# EAGLE design Down (EAGLE 8.6.0)

## Sheet 1 of 2
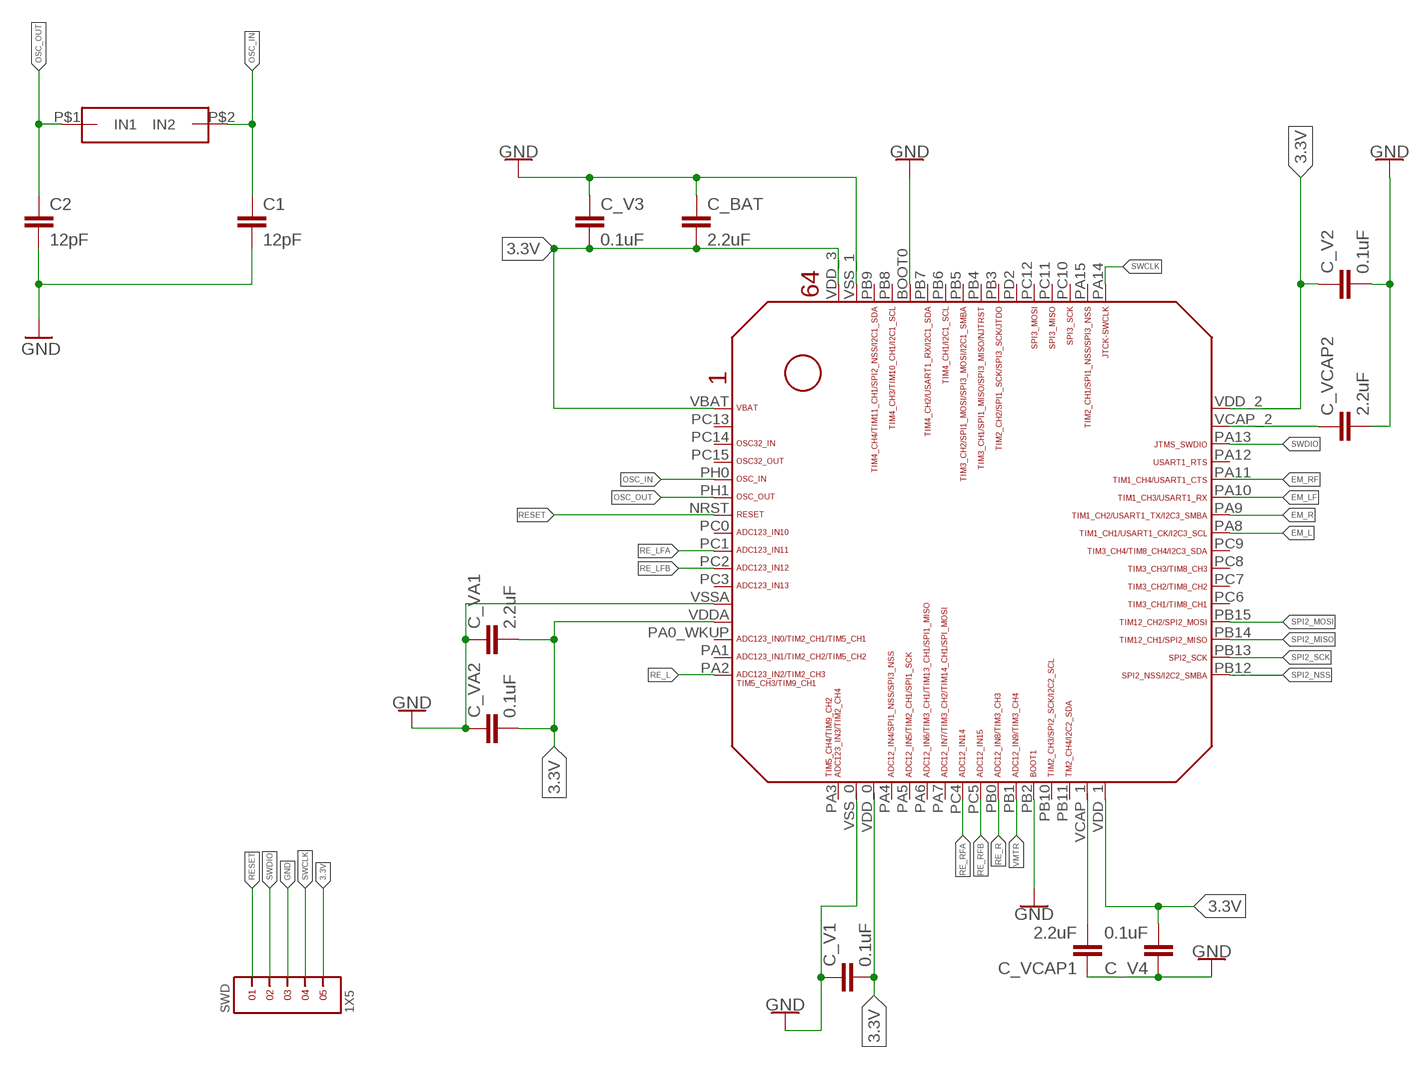
[diagram p0: schematic, sheet 1, part 1 of 3]
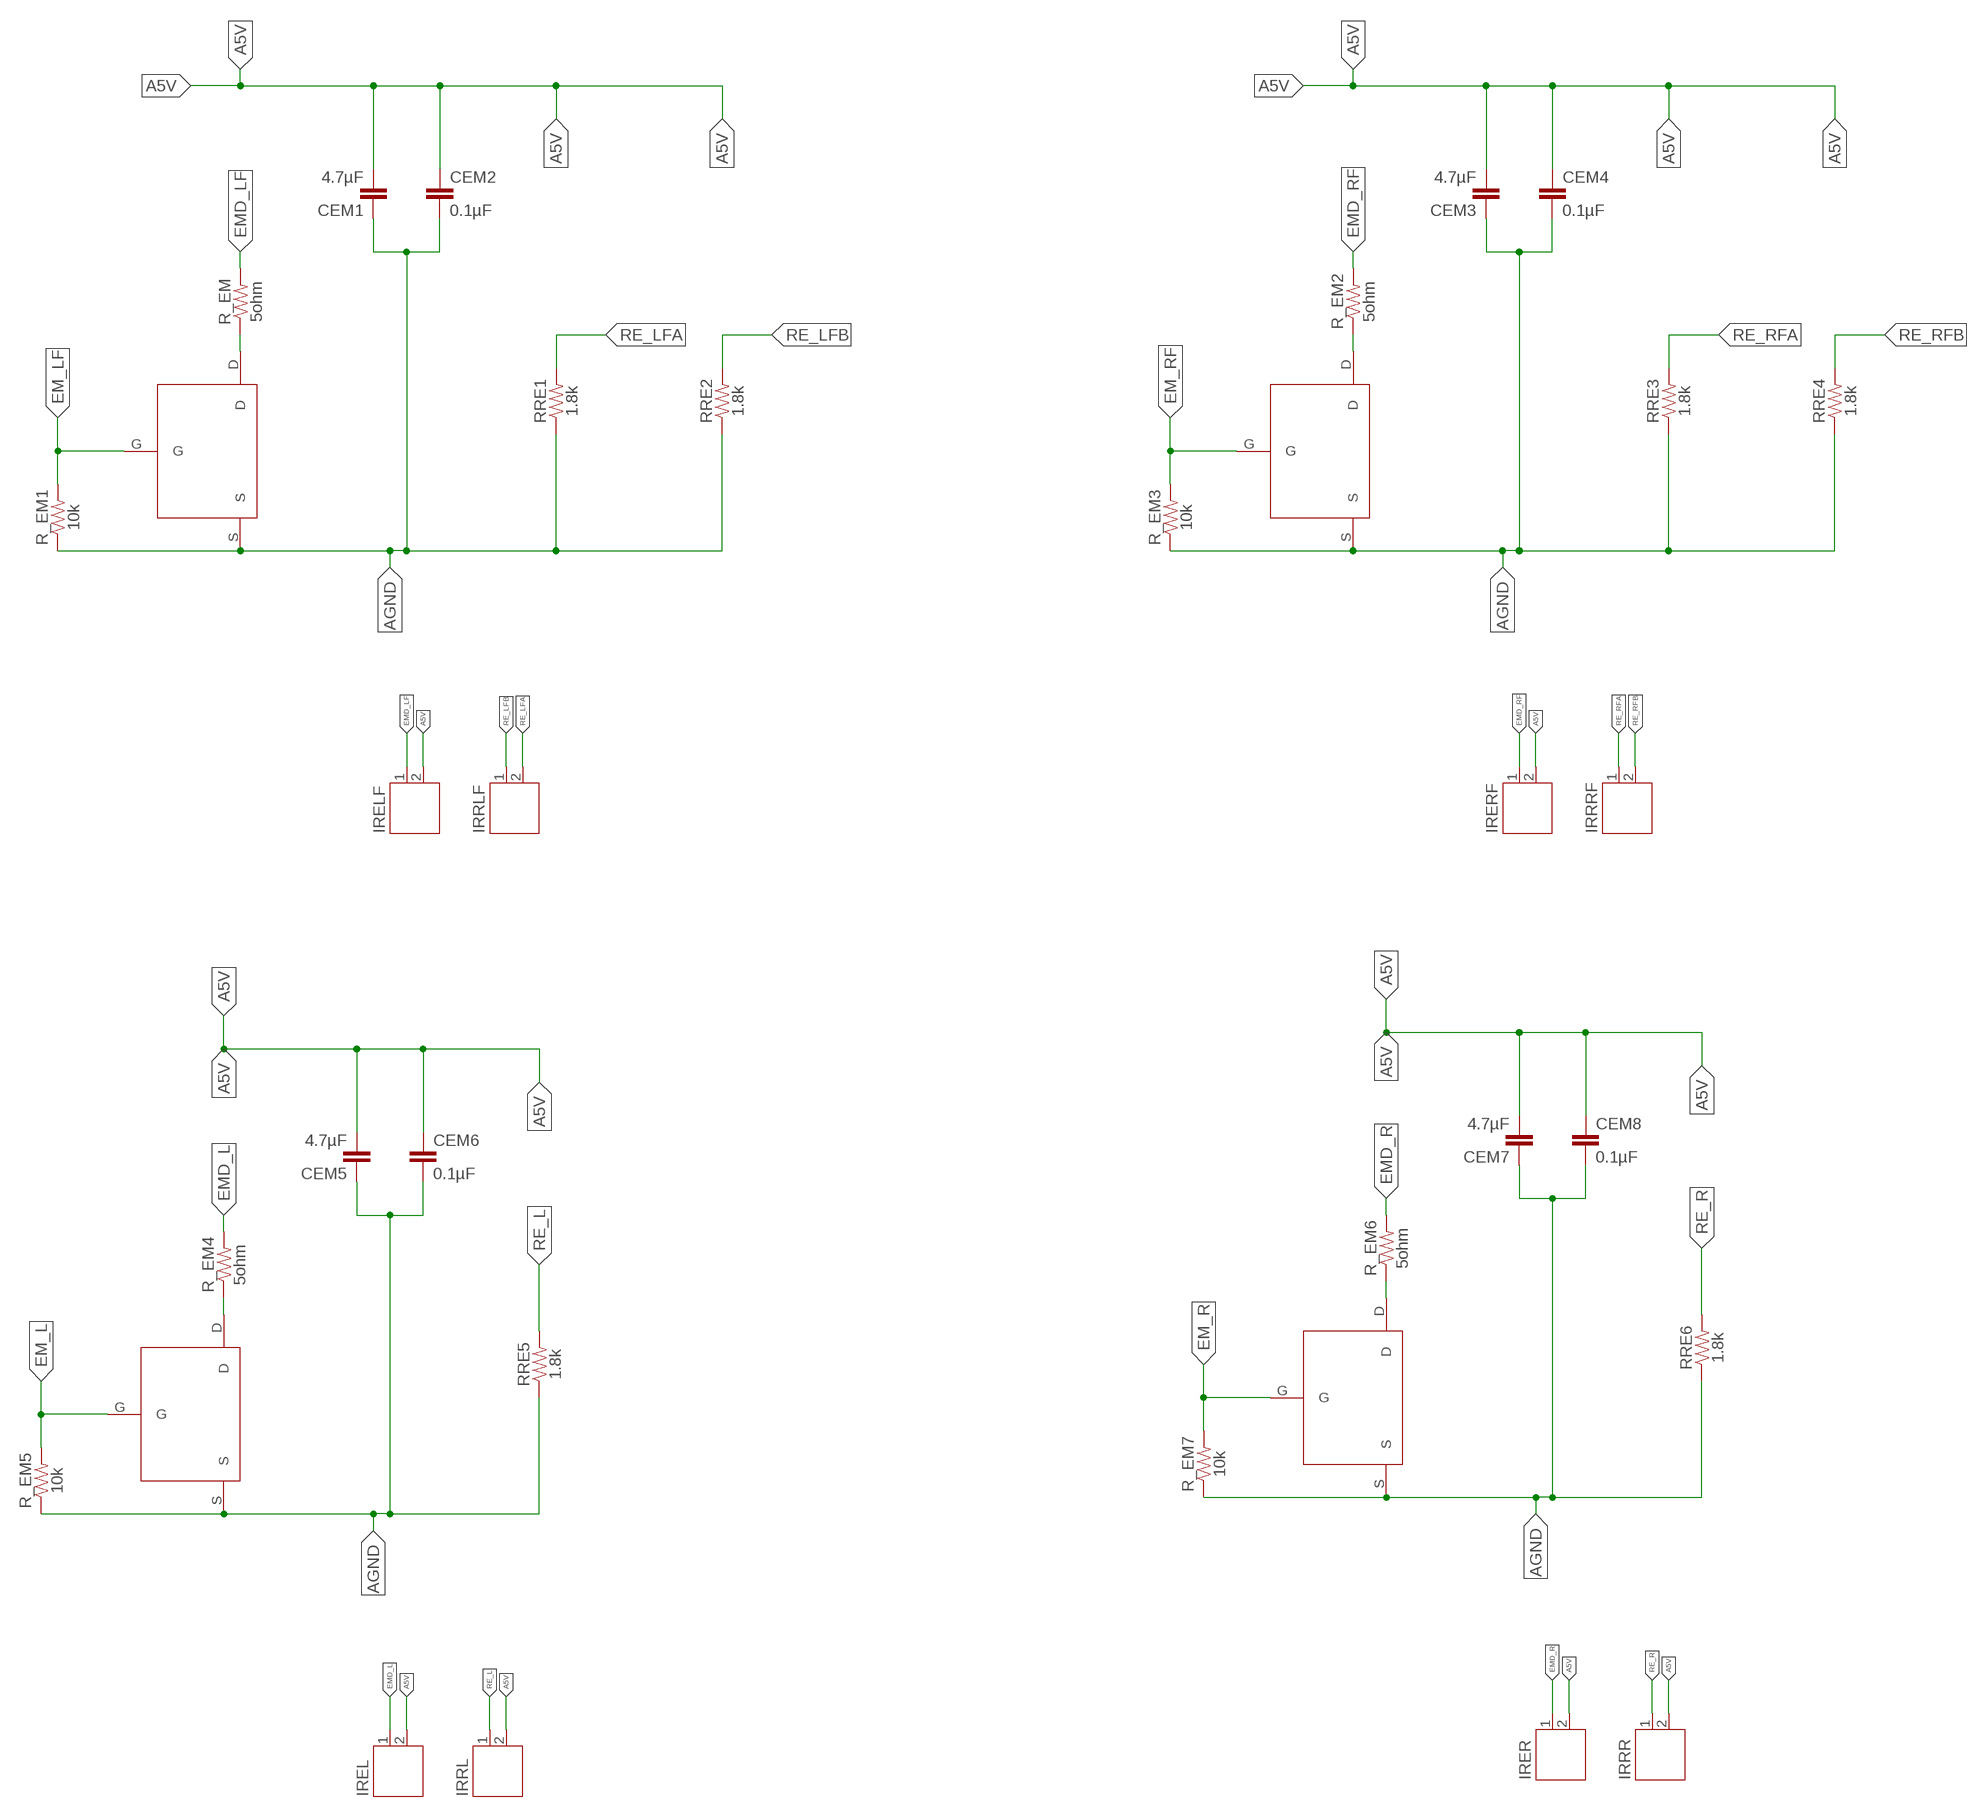
[diagram p1: schematic, sheet 1, part 2 of 3]
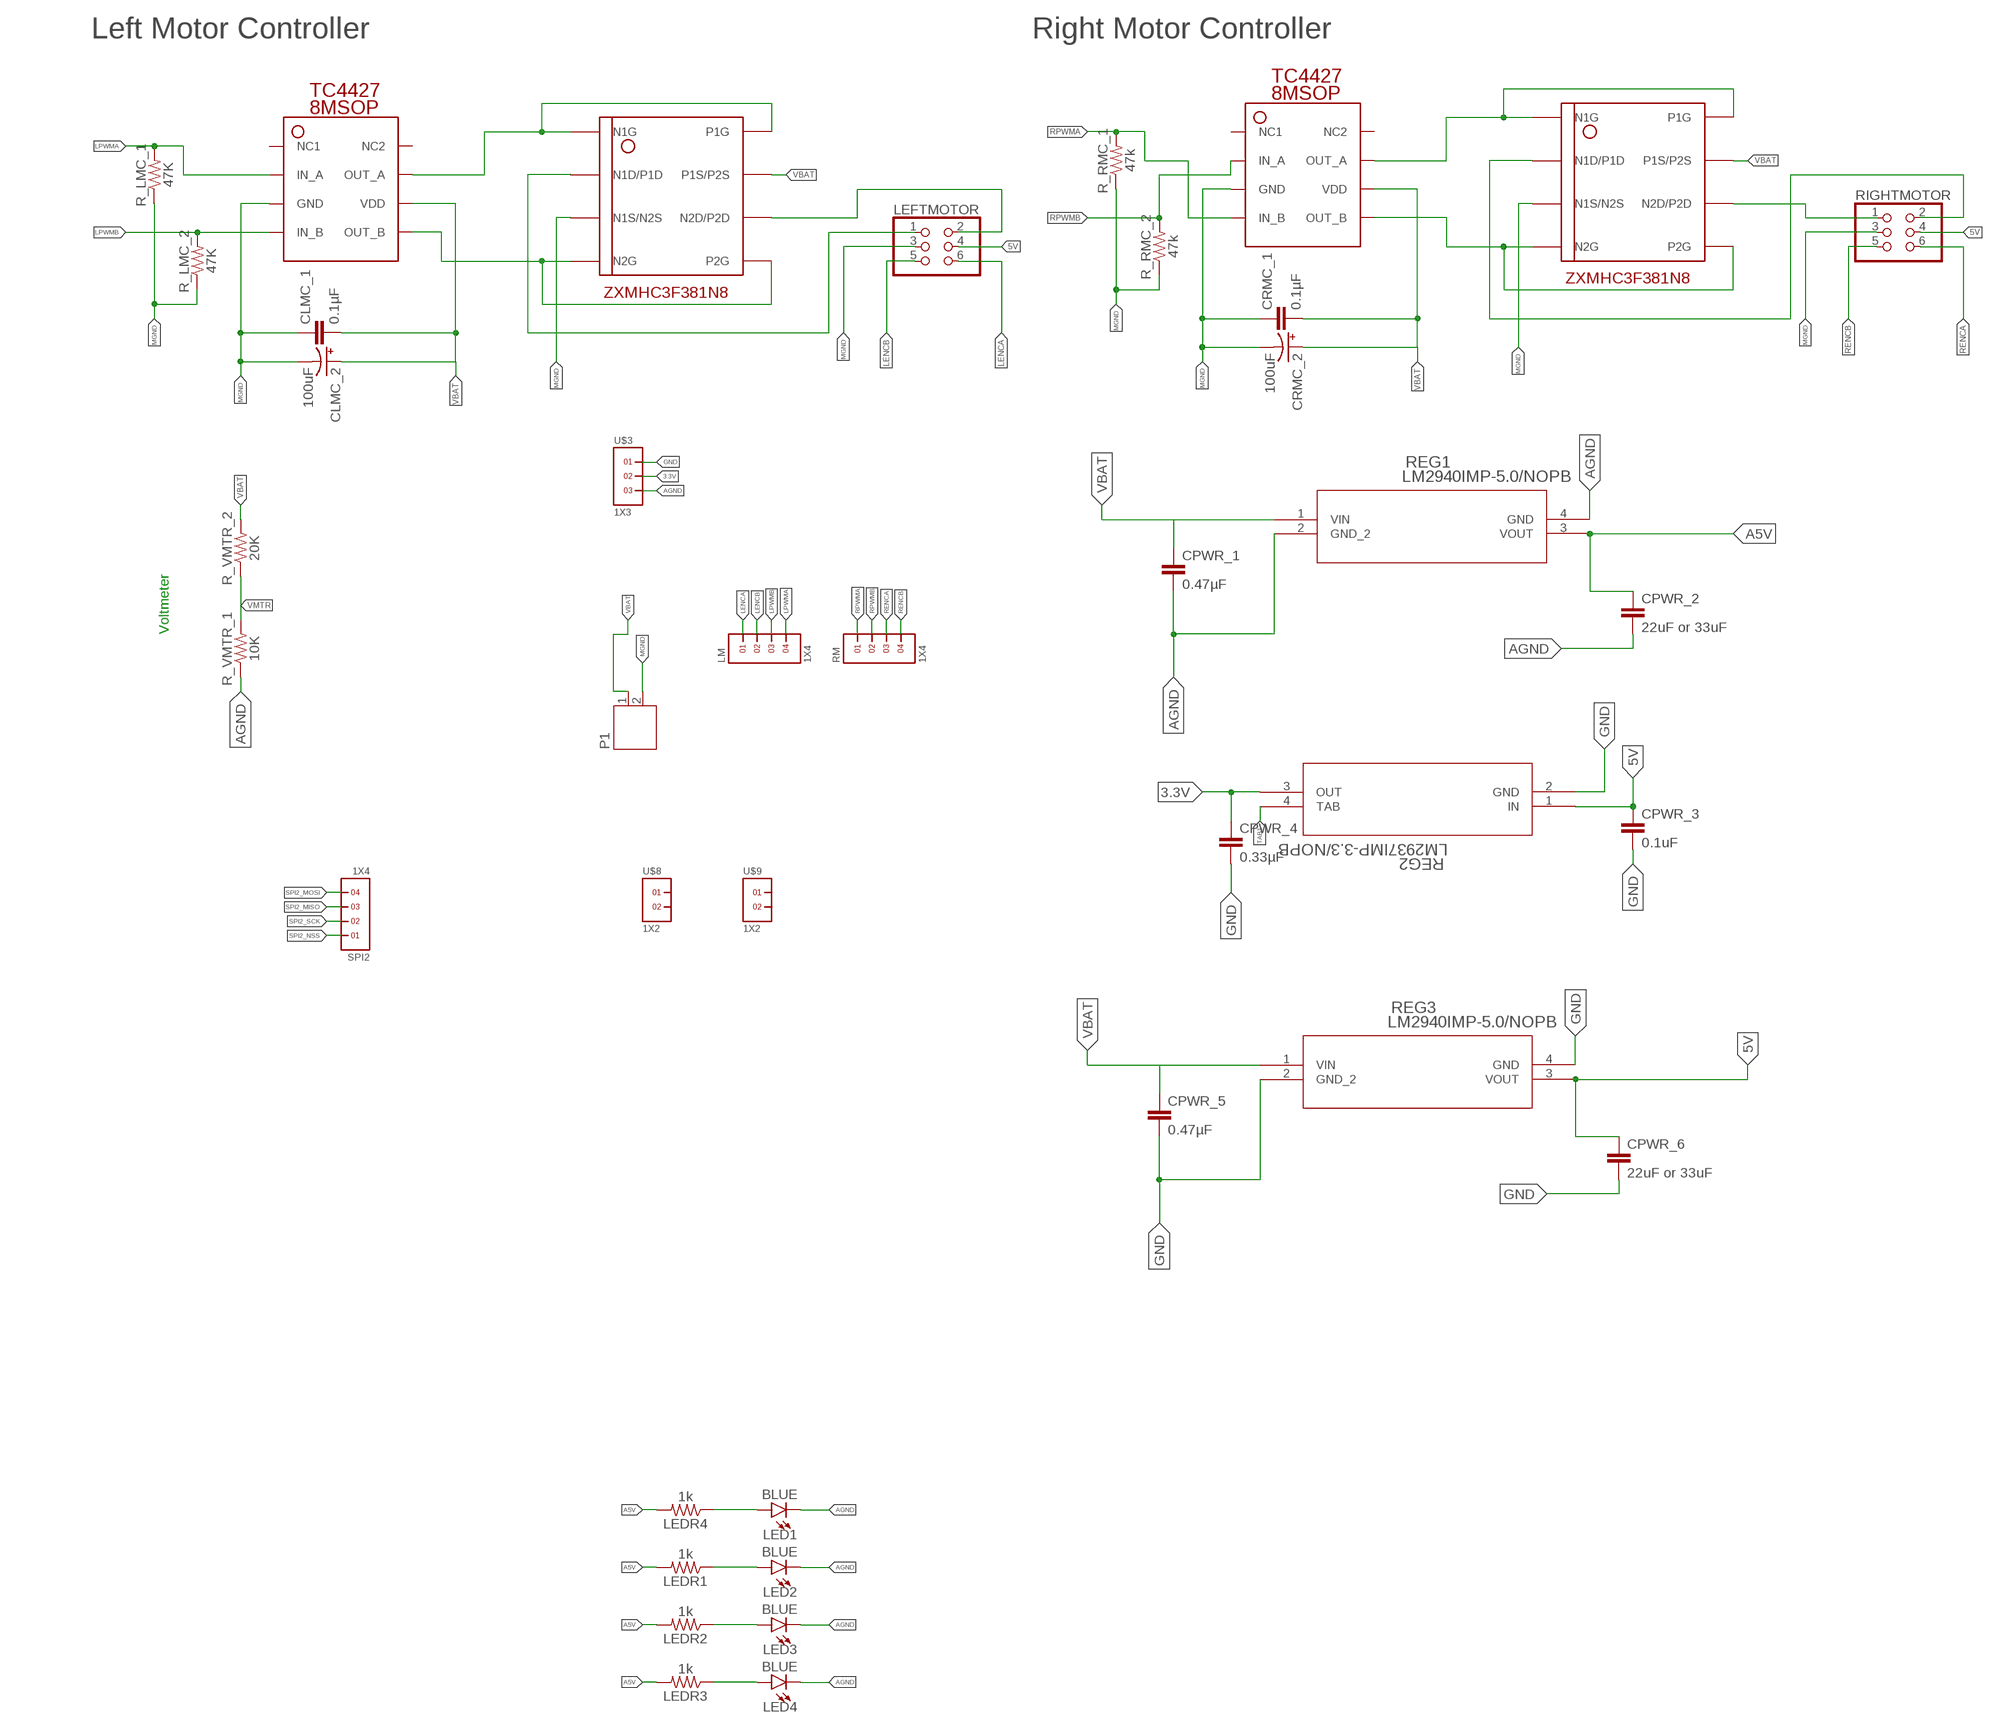
[diagram p2: schematic, sheet 1, part 3 of 3]

### Parts
C1  12pF  22PF-0603-50V-5%  [0603]
C2  12pF  22PF-0603-50V-5%  [0603]
C_BAT  2.2uF  22UF-0805-6.3V-20%  [0805]
C_V1  0.1uF  22UF-0805-6.3V-20%  [0805]
C_V2  0.1uF  22UF-0805-6.3V-20%  [0805]
C_V3  0.1uF  22UF-0805-6.3V-20%  [0805]
C_V4  0.1uF  22UF-0805-6.3V-20%  [0805]
C_VA1  2.2uF  22UF-0805-6.3V-20%  [0805]
C_VA2  0.1uF  22UF-0805-6.3V-20%  [0805]
C_VCAP1  2.2uF  22UF-0805-6.3V-20%  [0805]
C_VCAP2  2.2uF  22UF-0805-6.3V-20%  [0805]
CEM1  4.7µF  0.33UF/330NF-0805-50V-10%  [0805]
CEM2  0.1µF  0.33UF/330NF-0805-50V-10%  [0805]
CEM3  4.7µF  0.33UF/330NF-0805-50V-10%  [0805]
CEM4  0.1µF  0.33UF/330NF-0805-50V-10%  [0805]
CEM5  4.7µF  0.33UF/330NF-0805-50V-10%  [0805]
CEM6  0.1µF  0.33UF/330NF-0805-50V-10%  [0805]
CEM7  4.7µF  0.33UF/330NF-0805-50V-10%  [0805]
CEM8  0.1µF  0.33UF/330NF-0805-50V-10%  [0805]
CLMC_1  0.1µF  0.33UF/330NF-0805-50V-10%  [0805]
CLMC_2  100uF  100UF-POLAR-EIA7343-10V-10%(TANT)  [EIA7343]
CPWR_1  0.47µF  0.33UF/330NF-0805-50V-10%  [0805]
CPWR_2  22uF or 33uF  0.33UF/330NF-0805-50V-10%  [0805]
CPWR_3  0.1uF  0.33UF/330NF-0805-50V-10%  [0805]
CPWR_4  0.33µF  0.33UF/330NF-0805-50V-10%  [0805]
CPWR_5  0.47µF  0.33UF/330NF-0805-50V-10%  [0805]
CPWR_6  22uF or 33uF  0.33UF/330NF-0805-50V-10%  [0805]
CRMC_1  0.1µF  0.33UF/330NF-0805-50V-10%  [0805]
CRMC_2  100uF  100UF-POLAR-EIA7343-10V-10%(TANT)  [EIA7343]
IREL  JST-PH2  [JST-PH2]
IRELF  JST-PH2  [JST-PH2]
IRER  JST-PH2  [JST-PH2]
IRERF  JST-PH2  [JST-PH2]
IRRL  JST-PH2  [JST-PH2]
IRRLF  JST-PH2  [JST-PH2]
IRRR  JST-PH2  [JST-PH2]
IRRRF  JST-PH2  [JST-PH2]
LED1  BLUE  LED-BLUE1206  [LED-1206]
LED2  BLUE  LED-BLUE1206  [LED-1206]
LED3  BLUE  LED-BLUE1206  [LED-1206]
LED4  BLUE  LED-BLUE1206  [LED-1206]
LEDR1  1k  0.75OHM-0805-1/4W-1%  [0805]
LEDR2  1k  0.75OHM-0805-1/4W-1%  [0805]
LEDR3  1k  0.75OHM-0805-1/4W-1%  [0805]
LEDR4  1k  0.75OHM-0805-1/4W-1%  [0805]
LEFTMOTOR  PINHD-2X3  [2X03]
LM  1X4  [1X4]
P1  JST-PH2  [JST-PH2]
R_EM  5ohm  0.75OHM-0805-1/4W-1%  [0805]
R_EM1  10k  0.75OHM-0805-1/4W-1%  [0805]
R_EM2  5ohm  0.75OHM-0805-1/4W-1%  [0805]
R_EM3  10k  0.75OHM-0805-1/4W-1%  [0805]
R_EM4  5ohm  0.75OHM-0805-1/4W-1%  [0805]
R_EM5  10k  0.75OHM-0805-1/4W-1%  [0805]
R_EM6  5ohm  0.75OHM-0805-1/4W-1%  [0805]
R_EM7  10k  0.75OHM-0805-1/4W-1%  [0805]
R_LMC_1  47K  0.75OHM-0805-1/4W-1%  [0805]
R_LMC_2  47K  0.75OHM-0805-1/4W-1%  [0805]
R_RMC_1  47k  0.75OHM-0805-1/4W-1%  [0805]
R_RMC_2  47k  0.75OHM-0805-1/4W-1%  [0805]
R_VMTR_1  10K  0.75OHM-0805-1/4W-1%  [0805]
R_VMTR_2  20K  0.75OHM-0805-1/4W-1%  [0805]
REG1  LM2940IMP-5.0/NOPB  [MP04A]
REG2  LM2937IMP-3.3/NOPB  [MP04A]
REG3  LM2940IMP-5.0/NOPB  [MP04A]
RIGHTMOTOR  PINHD-2X3  [2X03]
RM  1X4  [1X4]
RRE1  1.8k  0.75OHM-0805-1/4W-1%  [0805]
RRE2  1.8k  0.75OHM-0805-1/4W-1%  [0805]
RRE3  1.8k  0.75OHM-0805-1/4W-1%  [0805]
RRE4  1.8k  0.75OHM-0805-1/4W-1%  [0805]
RRE5  1.8k  0.75OHM-0805-1/4W-1%  [0805]
RRE6  1.8k  0.75OHM-0805-1/4W-1%  [0805]
SPI2  1X4  [1X4]
SWD  1X5  [1X5]
U$1  STM32F405/415_LQFP64  [STM32F405/415_LQFP64]
U$2  OSC  [OSC]
U$3  1X3  [1X3]
U$4  MCH3474  [MCH3474]
U$5  MCH3474  [MCH3474]
U$6  MCH3474  [MCH3474]
U$7  MCH3474  [MCH3474]
U$8  1X2  [1X2]
U$9  1X2  [1X2]
U$15  TC4427(8MSOP)  [TC4427(8MSOP)]
U$16  ZXMHC3F381N8  [ZXMHC3F381N8]
U$17  TC4427(8MSOP)  [TC4427(8MSOP)]
U$18  ZXMHC3F381N8  [ZXMHC3F381N8]

### Nets
3.3V: C_BAT.2 C_V1.2 C_V2.1 C_V3.2 C_V4.2 C_VA1.2 C_VA2.2 CPWR_4.1 REG2.3(OUT) SWD.5 U$1.VBAT U$1.VDD_0 U$1.VDD_1 U$1.VDD_2 U$1.VDD_3 U$1.VDDA U$3.2
5V: CPWR_3.1 CPWR_6.1 LEFTMOTOR.4 REG2.1(IN) REG3.3(VOUT) RIGHTMOTOR.4
A5V: CEM1.2 CEM2.1 CEM3.2 CEM4.1 CEM5.2 CEM6.1 CEM7.2 CEM8.1 CPWR_2.1 IREL.2 IRELF.2 IRER.2 IRERF.2 IRRL.2 IRRR.2 LEDR1.2 LEDR2.2 LEDR3.2 LEDR4.2 REG1.3(VOUT)
AGND: CEM1.1 CEM2.2 CEM3.1 CEM4.2 CEM5.1 CEM6.2 CEM7.1 CEM8.2 CPWR_1.2 CPWR_2.2 LED1.C LED2.C LED3.C LED4.C R_EM1.1 R_EM3.1 R_EM5.1 R_EM7.1 R_VMTR_1.1 REG1.2(GND_2) REG1.4(GND) RRE1.1 RRE2.1 RRE3.1 RRE4.1 RRE5.1 RRE6.1 U$3.3 U$4.S U$5.S U$6.S U$7.S
EM_L: R_EM5.2 U$1.PA8 U$4.G
EM_LF: R_EM1.2 U$1.PA10 U$5.G
EM_R: R_EM7.2 U$1.PA9 U$7.G
EM_RF: R_EM3.2 U$1.PA11 U$6.G
EMD_L: IREL.1 R_EM4.2
EMD_LF: IRELF.1 R_EM.2
EMD_R: IRER.1 R_EM6.2
EMD_RF: IRERF.1 R_EM2.2
GND: C1.2 C2.2 C_BAT.1 C_V1.1 C_V2.2 C_V3.1 C_V4.1 C_VA1.1 C_VA2.1 C_VCAP1.1 C_VCAP2.2 CPWR_3.2 CPWR_4.2 CPWR_5.2 CPWR_6.2 REG2.2(GND) REG3.2(GND_2) REG3.4(GND) SWD.3 U$1.BOOT0 U$1.PB2 U$1.VSS_0 U$1.VSS_1 U$1.VSSA U$3.1
L: LEFTMOTOR.1 U$16.N1D/P1D
LENCA: LEFTMOTOR.6 LM.1
LENCB: LEFTMOTOR.5 LM.2
LPWMA: LM.4 R_LMC_1.2 U$15.IN_A
LPWMB: LM.3 R_LMC_2.2 U$15.IN_B
MGND: CLMC_1.1 CLMC_2.C(-) CRMC_1.1 CRMC_2.C(-) LEFTMOTOR.3 P1.2 R_LMC_1.1 R_LMC_2.1 R_RMC_1.1 R_RMC_2.1 RIGHTMOTOR.3 U$15.GND U$16.N1S/N2S U$17.GND U$18.N1S/N2S
N$1: R_EM.1 U$5.D
N$2: R_EM2.1 U$6.D
N$3: R_EM4.1 U$4.D
N$4: R_EM6.1 U$7.D
N$5: LED2.A LEDR1.1
N$6: LED3.A LEDR2.1
N$7: LED4.A LEDR3.1
N$8: LED1.A LEDR4.1
N$28: LEFTMOTOR.2 U$16.N2D/P2D
N$36: RIGHTMOTOR.1 U$18.N2D/P2D
OSC_IN: C1.1 U$1.PH0 U$2.P$2(IN2)
OSC_OUT: C2.1 U$1.PH1 U$2.P$1(IN1)
OUT_A: U$15.OUT_A U$16.N1G U$16.P1G
OUT_B: U$15.OUT_B U$16.N2G U$16.P2G
OUTA: U$17.OUT_A U$18.N1G U$18.P1G
OUTB: U$17.OUT_B U$18.N2G U$18.P2G
R: RIGHTMOTOR.2 U$18.N1D/P1D
RE_L: IRRL.1 RRE5.2 U$1.PA2
RE_LFA: IRRLF.2 RRE1.2 U$1.PC1
RE_LFB: IRRLF.1 RRE2.2 U$1.PC2
RE_R: IRRR.1 RRE6.2 U$1.PB0
RE_RFA: IRRRF.1 RRE3.2 U$1.PC4
RE_RFB: IRRRF.2 RRE4.2 U$1.PC5
RENCA: RIGHTMOTOR.6 RM.3
RENCB: RIGHTMOTOR.5 RM.4
RESET: SWD.1 U$1.NRST
RPWMA: R_RMC_1.2 RM.1 U$17.IN_B
RPWMB: R_RMC_2.2 RM.2 U$17.IN_A
SPI2_MISO: SPI2.3 U$1.PB14
SPI2_MOSI: SPI2.4 U$1.PB15
SPI2_NSS: SPI2.1 U$1.PB12
SPI2_SCK: SPI2.2 U$1.PB13
SWCLK: SWD.4 U$1.PA14
SWDIO: SWD.2 U$1.PA13
TAB1: REG2.4(TAB)
VBAT: CLMC_1.2 CLMC_2.A(+) CPWR_1.1 CPWR_5.1 CRMC_1.2 CRMC_2.A(+) P1.1 R_VMTR_2.2 REG1.1(VIN) REG3.1(VIN) U$15.VDD U$16.P1S/P2S U$17.VDD U$18.P1S/P2S
VCAP_1: C_VCAP1.2 U$1.VCAP_1
VCAP_2: C_VCAP2.1 U$1.VCAP_2
VMTR: R_VMTR_1.2 R_VMTR_2.1 U$1.PB1
Unconnected: U$1.PA0_WKUP(PA0_AKUP) U$1.PA1 U$1.PA3 U$1.PA4 U$1.PA5 U$1.PA6 U$1.PA7 U$1.PA12 U$1.PA15 U$1.PB3 U$1.PB4 U$1.PB5 U$1.PB6 U$1.PB7 U$1.PB8 U$1.PB9 U$1.PB10 U$1.PB11 U$1.PC0 U$1.PC3 U$1.PC6 U$1.PC7 U$1.PC8 U$1.PC9 U$1.PC10 U$1.PC11 U$1.PC12 U$1.PC13 U$1.PC14 U$1.PC15 U$1.PD2 U$8.1 U$8.2 U$9.1 U$9.2 U$15.NC1 U$15.NC2 U$17.NC1 U$17.NC2

### Notes on the sheet
- Left Motor Controller | Right Motor Controller
- Voltmeter

## Sheet 2 of 2

## Library data of the parts
C1 C2 = SparkFun-Capacitors:22PF: 22pF ceramic capacitors A capacitor is a passive two-terminal electrical component used to store electrical energy temporarily in an electric field.; PROD_ID: CAP-07876; VALUE: 22pF
C_BAT C_V1-C_V4 C_VA1 C_VA2 C_VCAP1 C_VCAP2 = SparkFun-Capacitors:22UF: 22µF ceramic capacitors A capacitor is a passive two-terminal electrical component used to store electrical energy temporarily in an electric field.; PROD_ID: CAP-08402; VALUE: 22uF
CEM1-CEM8 CLMC_1 CPWR_1-CPWR_3 CPWR_5 CPWR_6 CRMC_1 = SparkFun-Capacitors:0.33UF/330NF: 0.33µF/330nF ceramic capacitors A capacitor is a passive two-terminal electrical component used to store electrical energy temporarily in an electric field.; PROD_ID: CAP-08469; VALUE: 0.33µF
CLMC_2 CRMC_2 = SparkFun-Capacitors:100UF-POLAR: 100µF polarized capacitors A capacitor is a passive two-terminal electrical component used to store electrical energy temporarily in an electric field.; PROD_ID: CAP-07890
CPWR_4 = SparkFun-Capacitors:0.33UF/330NF: 0.33µF/330nF ceramic capacitors A capacitor is a passive two-terminal electrical component used to store electrical energy temporarily in an electric field.; PROD_ID: CAP-08469
IREL IRELF IRER IRERF IRRL IRRLF IRRR IRRRF P1 = jst-ph:JST-PH2
LED1-LED4 = SparkFun-LED:LED-BLUE: Blue SMD LED Used in manufacturing of various products at SparkFun Packages: 0603 - SMD 0603 package [Product Link] <http://www.digikey.com/product-detail/en/SMLE12BC7TT86/511-1589-2-ND/1641808> 1206 - SMD1206 package [Product Link] <http://www.digikey.com/product-detail/en/lite-on-inc/LTST-C150TBKT/160-1643-1-ND/573584> SparkFun Products: ESP8266 Thing-Dev Board <https://www.sparkfun.com/products/13711> RedBoard <https://www.sparkfun.com/products/12757>; PROD_ID: DIO-09911
LEDR1-LEDR4 R_EM R_EM1-R_EM7 R_LMC_1 R_LMC_2 R_RMC_1 R_RMC_2 R_VMTR_1 R_VMTR_2 RRE1-RRE6 = SparkFun-Resistors:0.75OHM: 0.75Ω resistor A resistor is a passive two-terminal electrical component that implements electrical resistance as a circuit element. Resistors act to reduce current flow, and, at the same time, act to lower voltage levels within circuits. - Wikipedia; PROD_ID: RES-08474; VALUE: 0.75
LEFTMOTOR RIGHTMOTOR = pinhead:PINHD-2X3: PIN HEADER
LM RM SPI2 = headers(2mm):1X4
REG1 REG3 = LM2940IMP-5.0:LM2940IMP-5.0/NOPB; 3D_LIBRARY_NAME: National_LDO; BASE_PN: LM2940; COMP: TypeLDO; COPYRIGHT: Copyright C 2015 Accelerated Designs. All rights reserved; LIBRARY: ReferenceLM2940IMP; MANUFACTURER_PART_NUMBER: LM2940IMP5.0NOPB; PIN: Count4; SYMBOL: NameLM2940IMP50; TYPE: LM2940IMP5.0; VENDOR: National Semiconductor; VERSION: 1
REG2 = LM2937IMP-3.3:LM2937IMP-3.3/NOPB; COPYRIGHT: Copyright C 2015 Accelerated Designs. All rights reserved; MANUFACTURER_PART_NUMBER: lm2937imp3_3nopb; VENDOR: National Semiconductor
SWD = headers(2mm):1X5
U$1 = STM32F405RG:STM32F405/415_LQFP64
U$2 = Cristal Oscillator:OSC
U$3 = headers(2mm):1X3
U$4-U$7 = MCH3474:MCH3474
U$8 U$9 = headers(2mm):1X2
U$15 U$17 = TC4427(8MSOP):TC4427(8MSOP)
U$16 U$18 = ZXMHC3F381N8:ZXMHC3F381N8

## Board
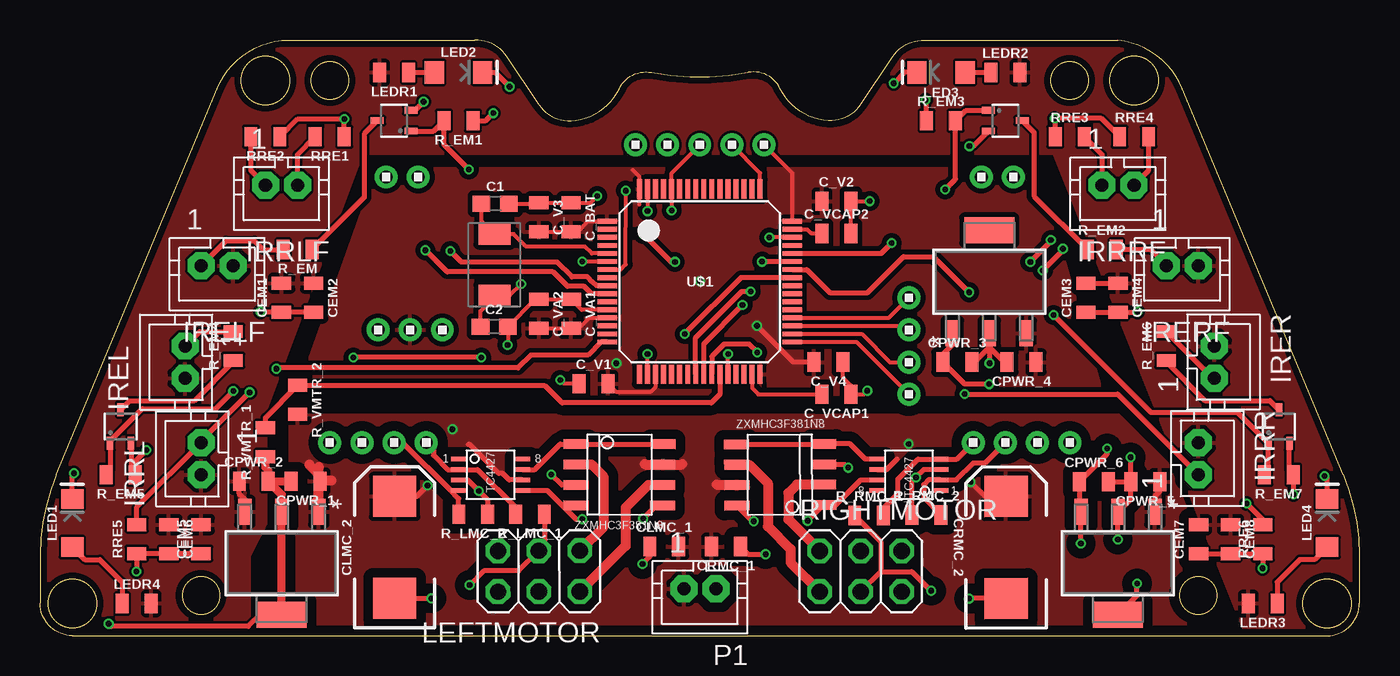
[diagram p3: board, top side]
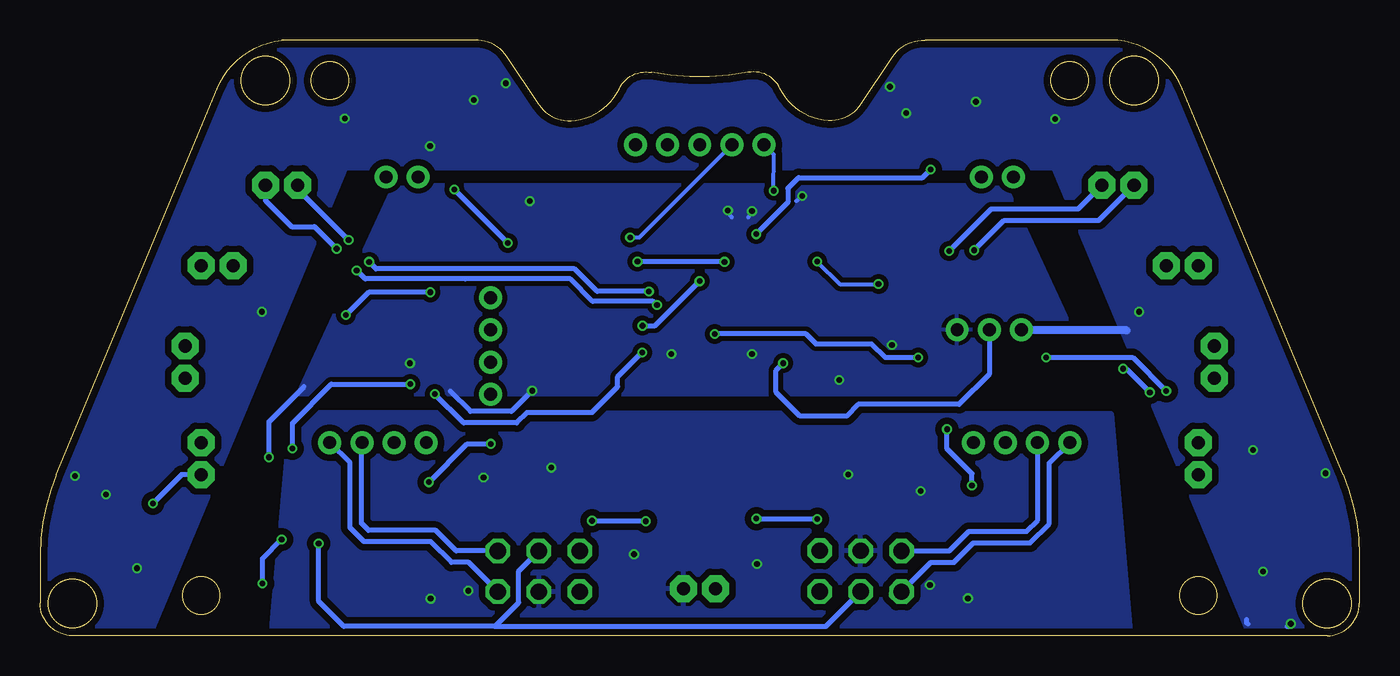
[diagram p4: board, bottom side, seen from below]

Size 82 x 37 mm. Coordinates in mm from the lower left corner, seen from the top.
Outline: 2,0 80,0 arc90 82,2 82,5 arc23 81,10 71,34 arc61 67,37 55,37 arc59 53,36 51,33 arc-59 49,32 arc-61 46,34 arc75 44,35 arc-22 38,35 arc75 36,34 arc-61 33,32 arc-59 31,33 29,36 arc59 27,37 15,37 arc61 11,34 1,10 arc23 0,5 0,2 arc90 2,0
Outline: circle at 10,2.5 radius 1.15
Outline: circle at 72,2.5 radius 1.15
Outline: circle at 14,34.5 radius 1.5
Outline: circle at 2,2 radius 1.5
Outline: circle at 80,2 radius 1.5
Outline: circle at 68,34.5 radius 1.5
Outline: circle at 18,34.5 radius 1.15
Outline: circle at 64,34.5 radius 1.15
Copper layers (1*16): Top 0.035559375mm / dielectric 1.6mm / Bottom 0.035559375mm
Design rules "oshpark-2layer *": minimum track width 6mil, minimum drill 10mil, track to track 6mil, track to pad 6mil, pad to pad 6mil, via to via 6mil, smd to smd 6mil, copper to edge 15mil, drill to drill 6mil, minimum pad ring 5mil, minimum via ring 5mil, stop-mask expansion 2.5mil, vias tented up to drill 12mil, thermal gap 10mil

### Footprints (pad centres in the part's own frame; a part is rotated, then mirrored left to right if it is on the bottom)
0603 = smd 1.1 x 1: 1 -0.85,0; 2 0.85,0
0805 = smd 0.8 x 1.2: 1 -0.9,0; 2 0.9,0
EIA7343 = smd 2.55 x 2.7: A 3.17,0; C -3.17,0
JST-PH2 = drill 0.813 pad 1.676 octagon: 1 1,0; 2 -1,0
LED-1206 = smd 1.2 x 1.4: A -1.5,0; C 1.5,0
2X03 = drill 1.016 octagon: 1 -2.54,-1.27; 2 -2.54,1.27; 3 0,-1.27; 4 0,1.27; 5 2.54,-1.27; 6 2.54,1.27
1X4 = drill 0.8 pad 1.422: 1 -3,0; 2 -1,0; 3 1,0; 4 3,0
MP04A = smd 1.6 x 0.838: 1 -3.2,2.3; 2 -3.2,0; 3 -3.2,-2.3 | smd 1.6 x 3.099: 4 3.2,0
1X5 = drill 0.8 pad 1.422: 1 -4,0; 2 -2,0; 3 0,0; 4 2,0; 5 4,0
STM32F405/415_LQFP64 = smd 0.3 x 1.2: BOOT0 -1.75,5.75; PA3 -3.75,-5.75; PA4 -2.25,-5.75; PA5 -1.75,-5.75; PA6 -1.25,-5.75; PA7 -0.75,-5.75; PA14 3.75,5.75; PA15 3.25,5.75; PB0 0.75,-5.75; PB1 1.25,-5.75; PB2 1.75,-5.75; PB3 0.75,5.75; PB4 0.25,5.75; PB5 -0.25,5.75; PB6 -0.75,5.75; PB7 -1.25,5.75; PB8 -2.25,5.75; PB9 -2.75,5.75; PB10 2.25,-5.75; PB11 2.75,-5.75; PC4 -0.25,-5.75; PC5 0.25,-5.75; PC10 2.75,5.75; PC11 2.25,5.75; PC12 1.75,5.75; PD2 1.25,5.75; VCAP_1 3.25,-5.75; VDD_0 -2.75,-5.75; VDD_1 3.75,-5.75; VDD_3 -3.75,5.75; VSS_0 -3.25,-5.75; VSS_1 -3.25,5.75 | smd 1.2 x 0.3: NRST -5.75,0.75; PA0_WKUP -5.75,-2.75; PA1 -5.75,-3.25; PA2 -5.75,-3.75; PA8 5.75,0.25; PA9 5.75,0.75; PA10 5.75,1.25; PA11 5.75,1.75; PA12 5.75,2.25; PA13 5.75,2.75; PB12 5.75,-3.75; PB13 5.75,-3.25; PB14 5.75,-2.75; PB15 5.75,-2.25; PC0 -5.75,0.25; PC1 -5.75,-0.25; PC2 -5.75,-0.75; PC3 -5.75,-1.25; PC6 5.75,-1.75; PC7 5.75,-1.25; PC8 5.75,-0.75; PC9 5.75,-0.25; PC13 -5.75,3.25; PC14 -5.75,2.75; PC15 -5.75,2.25; PH0 -5.75,1.75; PH1 -5.75,1.25; VBAT -5.75,3.75; VCAP_2 5.75,3.25; VDD_2 5.75,3.75; VDDA -5.75,-2.25; VSSA -5.75,-1.75
OSC = smd 1.3 x 2: P$1 0,0.1; P$2 3.8,0.1
1X3 = drill 0.8 pad 1.422: 1 -2,0; 2 0,0; 3 2,0
MCH3474 = smd 0.406 x 0.813: D 0,1.05; G -0.65,-1.05; S 0.65,-1.05
1X2 = drill 0.8 pad 1.422: 1 -1,0; 2 1,0
TC4427(8MSOP) = smd 0.95 x 0.3: GND -1.975,-0.325; IN_A -1.975,0.325; IN_B -1.975,-0.975; NC1 -1.975,0.975; NC2 1.975,0.975; OUT_A 1.975,0.325; OUT_B 1.975,-0.975; VDD 1.975,-0.325
ZXMHC3F381N8 = smd 0.6 x 1.55: N1D/P1D -0.635,-2.7; N1G -1.905,-2.7; N1S/N2S 0.635,-2.7; N2D/P2D 0.635,2.7; N2G 1.905,-2.7; P1G -1.905,2.7; P1S/P2S -0.635,2.7; P2G 1.905,2.7

### Placement (x,y rotation side)
C1  28.28,26.84 0 top
C2  28.22,19.2 0 top
C_BAT  33,26 270 top
C_V1  34.4,15.66 0 top
C_V2  49.5,27 0 top
C_V3  31,26 270 top
C_V4  49,17 180 top
C_VA1  33.01,20 270 top
C_VA2  31,20 270 top
C_VCAP1  49.5,15 180 top
C_VCAP2  49.5,25 0 top
CEM1  15,21 90 top
CEM2  17,21 270 top
CEM3  65,21 90 top
CEM4  67,21 270 top
CEM5  10,6 90 top
CEM6  8,6 270 top
CEM7  72,5.99 90 top
CEM8  74,6 270 top
CLMC_1  38.79,5.54 0 top
CLMC_2  22.03,5.49 90 top
CPWR_1  16.5,9.6 180 top
CPWR_2  13.28,9.6 0 top
CPWR_3  57.01,17 0 top
CPWR_4  61,17 180 top
CPWR_5  68.69,9.56 180 top
CPWR_6  65.5,9.56 0 top
CRMC_1  42.63,5.54 180 top
CRMC_2  60.05,5.48 90.1 top
IREL  9,17 90 top
IRELF  11,23 180 top
IRER  73,17 270 top
IRERF  71,23 180 top
IRRL  10,11 90 top
IRRLF  15,28 180 top
IRRR  72,11 270 top
IRRRF  67,28 180 top
LED1  2,7 90 top
LED2  26,35 0 top
LED3  56,35 180 top
LED4  80,7 90 top
LEDR1  22,35 180 top
LEDR2  60,35 0 top
LEDR3  76,2 180 top
LEDR4  6,2 0 top
LEFTMOTOR  31,4 180.1 top
LM  21,12 0 top
P1  41.01,2.92 180 top
R_EM  16,24 180 top
R_EM1  26,32 180 top
R_EM2  66,24 0 top
R_EM3  56,32 0 top
R_EM4  12,18 90 top
R_EM5  5,10 180 top
R_EM6  70,18 90 top
R_EM7  77,10 180 top
R_LMC_1  30.44,7.55 180 top
R_LMC_2  26.92,7.54 180 top
R_RMC_1  51.53,7.47 0 top
R_RMC_2  55.1,7.49 0 top
R_VMTR_1  14,12.01 90 top
R_VMTR_2  16,14.65 270 top
REG1  15.01,4.5 270 top
REG2  59,22 90 top
REG3  67,4.5 270 top
RIGHTMOTOR  51,4 0 top
RM  61,12 0 top
RRE1  18,31 180 top
RRE2  14,31 180 top
RRE3  64,31 0 top
RRE4  68,31 0 top
RRE5  6,6 90 top
RRE6  76,6 90 top
SPI2  54,18 90 top
SWD  41,30.5 0 top
U$1  41,22 0 top
U$2  28.34,21.15 90 top
U$3  23,19 180 top
U$4  5,13 0 top
U$5  22,32 90 top
U$6  60,32 270 top
U$7  77,13 0 top
U$8  22.5,28.5 0 top
U$9  59.5,28.5 0 top
U$15  28,10 0 top
U$16  36,10 269.9 top
U$17  54,10 180 top
U$18  46,10 90.3 top

### Tracks (layer width: path | path; a pad name or v marks a point on that pad's centre or on a via)
3.3V  (via drill 0.35)
  Top 0.254: C_V3.2 C_BAT.2 33.42,25.1 34.07,25.75 U$1.VBAT | C_VA2.2 C_VA1.2 33.49,19.1 34.14,19.75 U$1.VDDA | U$1.VDD_0 38.25,15.44 37.98,15.17 35.79,15.17 C_V1.2 | 37.24,26.78 U$1.VDD_3 37.25,28.53 36.85,28.93 | U$1.VDD_2 46.75,28.75 SWD.5
  Top 0.305: v44.56,19.26 45.84,17.98 45.84,17.97 46.82,17 C_V4.2
  Bottom 0.305: U$3.2 23,16.25 24.88,14.37 31.16,14.37 31.88,13.65 34.77,13.65 36.26,15.14 36.26,16.49 v35.82,16.93 | v44.56,19.26 43.78,19.26 v41.01,22.03
  pour Top (isolate 0.305): 16,15 21,29 62,29 66,15
5V  (via drill 0.35)
  Top 0.305: v64.69,5.73 REG3.3 64.6,7.8 CPWR_6.1 66.32,11.28 v66.32,11.63 | REG2.1 56.71,18.08 56.11,17.48 CPWR_3.1 57.48,15.63 v58.99,15.63
  Bottom 0.305: 53.74,0.57 63.13,0.57 64.69,2.13 v64.69,5.73 | 53.74,0.57 52.26,2.05 52.26,4.01 RIGHTMOTOR.4 | 53.74,0.57 33.16,0.57 LEFTMOTOR.4 | v66.32,11.63 66.32,13.21 63.9,15.63 v58.99,15.63
A5V
  Top 0.305: REG1.3 12.71,8.49 12.38,8.82 CPWR_2.1 | CEM3.2 CEM4.1
  pour Top: 13,-1 13,5 14,7 14,14 20,30 63,30 75,0 76,-2 91,-2 72,42 10,42 -10,-1
AGND  (via drill 0.35)
  Top 0.305: CPWR_2.2 14.42,9.6 | REG1.4 13.66,1.3 12.93,0.57 4.43,0.57 v4.26,0.74 | RRE1.1 v18.9,32.11 16.01,32.11 RRE2.1 | U$5.S 23.3,32.65 v23.83,33.18 | R_EM1.1 27.69,32 v28.16,32.47 | CEM2.2 CEM1.1 13.72,20.1 v13.69,20.13 | CEM3.1 CEM4.2 68.18,20.1 v68.21,20.13 | RRE3.1 63.1,32.11 v63.07,32.14 65.96,32.14 RRE4.1 | R_EM3.1 55.1,33.24 v55.05,33.29 | U$6.S 58.02,30.42 v57.76,30.42 | U$4.S 5.65,10.25 R_EM5.1 5.9,10.83 v6.6,11.53 | CEM5.1 CEM6.2 RRE5.1 6,4 v5.98,3.98 | CEM7.1 CEM8.2 RRE6.1 v76,4.2 v75.99,4.19 | v77.91,8.78 v77.9,8.79 R_EM7.1 77.65,10.25 U$7.S | LED1.C 2,10 v2.09,10.09 | LED4.C 80,9.76 v79.84,9.92 | LED3.C 53.73,35 v53.06,34.33 | LED2.C 28.29,35 v29.18,34.11
  Top 0.508: CPWR_2.2 14.18,10.26 14,10.44 R_VMTR_1.1 | CPWR_2.2 CPWR_1.2 | CPWR_2.2 15.01,8.77 REG1.2 REG1.4
  Bottom 0.305: 6.93,0.72 7,0.79 7,1 | v4.26,0.74 4.43,0.57 4.5,0.57
  Bottom 0.508: U$3.3 14.52,19 14.47,18.95
  pour Bottom (isolate 0.406): 6,-2 19,29 63,29 76,-2 89,-2 70,44 11,44 -8,-2
EM_L  (via drill 0.35)
  Top 0.305: v27.43,17.29 v19.47,17.29 | v12,15.2 10.91,14.11 6.35,14.11 4.35,12.11 U$4.G 4.35,10.25 R_EM5.2 | v40.06,18.75 43.56,22.25 U$1.PA8
  Bottom 0.305: v40.06,18.75 34.39,18.75 33.78,18.14 30.32,18.14 29.47,17.29 v27.43,17.29 | v19.47,17.29 14.09,17.29 v12,15.2
EM_LF  (via drill 0.35)
  Top 0.305: U$5.G 24.45,31.35 R_EM1.2 25.1,30.51 v26.65,28.96 | U$1.PA10 v44.88,23.25 v44.87,23.24 | v37.49,24.95 39.21,23.23 v39.46,23.23
  Bottom 0.305: v26.65,28.96 27.15,28.46 34.86,28.46 35.52,27.8 35.52,26.92 v37.49,24.95 | v39.46,23.23 v44.86,23.23 v44.87,23.24
EM_R  (via drill 0.35)
  Top 0.305: R_EM7.2 76.35,10.25 U$7.G 74.43,13.87 69.05,13.87 v63,19.92 | U$1.PA9 47.65,22.75 49.08,21.32 51.43,21.32 53.67,23.56 55.52,23.56 v57.74,21.34
  Bottom 0.305: v57.74,21.34 61.58,21.34 v63,19.92
EM_RF  (via drill 0.35)
  Top 0.305: U$6.G 57.55,32.65 R_EM3.2 56.9,28.37 v56.26,27.73 | U$1.PA11 52.28,23.75 v52.93,24.4
  Bottom 0.305: v52.93,24.4 v56.26,27.73
EMD_L
  Top 0.305: IREL.1 9.9,18.9 R_EM4.2
EMD_LF
  Top 0.305: IRELF.1 11.55,24.55 13.3,24.55 13.87,23.98 15.08,23.98 R_EM.2
EMD_R
  Top 0.305: R_EM6.2 72.9,16 IRER.1
EMD_RF
  Top 0.305: R_EM2.2 69,24 IRERF.1
GND  (via drill 0.35)
  Top 0.254: C1.2 30.94,26.84 C_V3.1 C_BAT.1 34.21,26.9 v34.63,27.32 | C_V4.1 49.91,16.03 50.4,15.54 C_VCAP1.1 51.2,15 v51.42,15.22 | U$1.VSS_0 v37.75,17.51 | v29.05,18.06 29.07,18.08 C2.2 30.77,20.9 C_VA2.1 C_VA1.1 33.66,20.25 U$1.VSSA | C_V1.1 32.56,15.66 v32.33,15.89 | U$1.PB2 v42.75,17.5 v42.76,17.51 | SWD.3 39.25,28.75 U$1.BOOT0 v39.25,26.42 | U$1.VSS_1 v37.75,26.38 | C_VCAP2.2 C_V2.2 v51.57,27
  Top 0.305: CPWR_6.2 CPWR_5.2 | CPWR_5.2 67.79,8.49 REG3.2 v66.99,5.98 | CPWR_3.2 58.07,17 59,17.93 | 59,17.93 REG2.2 | CPWR_4.2 59.93,17 59,17.93 | 59,17.93 v59,16.94 v59.01,16.93 | CPWR_5.2 v67.79,11.08 v67.78,11.09 | REG3.4 68.18,2.48 v68.18,3.24
  Bottom 0.254: v34.63,27.32 34.68,27.32 35,27 | v39.25,26.42 39.25,26.25 39,26 | v37.75,26.38 37.75,26.25 38,26
  Bottom 0.305: v67.78,11.09 67.78,13.3 65.6,15.48 | v68.18,3.24 68.18,4.79 v66.99,5.98 | v51.42,15.22 52.7,13.94 55.25,13.94 56.51,15.2
  pour Bottom (isolate 0.305): 16,15 22,28 60,28 66,15
L
  Top 0.61: U$16.N1D/P1D 34.27,10.64 35.01,9.9 35.01,6.75 LEFTMOTOR.1
LENCA
  Bottom 0.305: LM.1 19.27,10.73 19.27,6.96 20.47,5.76 24,5.76 25.2,4.56 26.63,4.56 LEFTMOTOR.6
LENCB
  Bottom 0.305: LM.2 19.99,7.18 20.69,6.48 24.28,6.48 25.49,5.27 LEFTMOTOR.5
LPWMA
  Top 0.305: LM.4 24.44,11.56 24.44,11.2 25.31,10.32 U$15.IN_A 27.19,10.32 29.54,7.97 R_LMC_1.2
LPWMB
  Top 0.305: 22.39,12 LM.3 22.53,12 25.51,9.02 | 25.51,9.02 U$15.IN_B | R_LMC_2.2 26.02,8.51 25.51,9.02
MGND  (via drill 0.35)
  Top 0.305: CLMC_2.C v24.33,2.32 | U$15.GND 26.58,9.68 v27.26,8.99 27.83,8.42 27.82,8.41 R_LMC_2.1 | R_LMC_1.1 31.34,5.62 LEFTMOTOR.3 29.74,4.02 27.57,4.02 v26.69,3.14 | U$16.N1S/N2S 32.41,9.37 v31.77,10.01 | U$18.N1S/N2S 50.02,10.65 v50.23,10.44 | R_RMC_1.1 52.26,5.84 52.26,3.99 | 52.26,3.99 RIGHTMOTOR.3 | CRMC_2.C v57.74,2.31 v57.73,2.3 | U$17.GND 54.94,10.32 v54.44,9.83 54.2,9.59 R_RMC_2.1 | 52.26,3.99 54.18,3.99 v55.38,2.79 | v37.44,4.45 37.89,4.9 CLMC_1.1 | CRMC_1.1 44.01,5.06 v45.09,5.06
  pour Bottom (isolate 0.406): 15.42,13.81 14,-2.27 67.82,-2.03 66.4,13.9
N$1
  Top 0.305: U$5.D 20.14,31.19 20.14,27.24 R_EM.1
N$2
  Top 0.305: U$6.D 61.78,31.27 61.78,27.32 R_EM2.1
N$3
  Top 0.305: R_EM4.1 12,17.01 9.57,14.58 5.53,14.58 U$4.D
N$4
  Top 0.305: R_EM6.1 70,17.01 72.41,14.6 76.45,14.6 U$7.D
N$5
  Top 0.305: LEDR1.1 LED2.A
N$6
  Top 0.305: LED3.A LEDR2.1
N$7
  Top 0.305: LED4.A 79.22,4.72 78.29,4.72 76.9,3.34 LEDR3.1
N$8
  Top 0.305: LED1.A 2.78,4.72 3.71,4.72 5.1,3.34 LEDR4.1
N$28
  Top 0.61: U$16.N2D/P2D 37.79,9.36 36.39,7.96 36.39,5.59 LEFTMOTOR.2
N$36
  Top 0.61: U$18.N2D/P2D 44.09,10.62 45.23,9.48 45.23,6.79 46.65,5.37 46.65,4.54 RIGHTMOTOR.1
OSC_IN
  Top 0.254: U$1.PH0 34.29,23.75 33.86,24.18 30.21,24.18 29.44,24.95 U$2.P$2 27.43,25.76 C1.1
OSC_OUT  (via drill 0.35)
  Top 0.254: U$1.PH1 v33.7,23.25 | v29.89,21.85 29.19,21.15 28.35,21.15 | 28.35,21.15 U$2.P$1 | C2.1 27.37,20.17 28.35,21.15
  Bottom 0.254: v33.7,23.25 32.3,21.85 v29.89,21.85
OUT_A
  Top 0.305: U$15.OUT_A 30.74,10.32 32.32,11.9 U$16.N1G U$16.P1G
OUT_B  (via drill 0.35)
  Top 0.305: U$15.OUT_B 31.52,9.02 32.44,8.1 | 32.44,8.1 U$16.N2G | 32.44,8.1 33.3,7.24 v33.69,7.24 | v37.48,7.27 38.3,8.09 U$16.P2G
  Bottom 0.305: v33.69,7.24 37.45,7.24 v37.48,7.27
OUTA  (via drill 0.35)
  Top 0.305: U$18.N1G 49.44,8.11 51,9.68 U$17.OUT_A | 43.56,8.08 U$18.P1G 44.28,7.11 v44.35,7.11 | 48.49,8.11 U$18.N1G | v47.7,7.14 48.67,8.11 U$18.N1G
  Bottom 0.305: v44.35,7.11 47.67,7.11 v47.7,7.14
OUTB
  Top 0.305: U$18.P2G 48.66,11.89 U$18.N2G 50.34,11.92 51.28,10.98 U$17.OUT_B
R
  Top 0.61: U$18.N1D/P1D 47.03,9.38 46.5,8.85 46.5,7.23 RIGHTMOTOR.2
RE_L  (via drill 0.35)
  Top 0.305: U$1.PA2 34.86,18.25 34.04,17.43 30.51,17.43 29.72,16.64 14.74,16.64 v14.69,16.59 | v13.02,15.12 10,12.1 IRRL.1 6,8 RRE5.2
  Bottom 0.305: v14.69,16.59 14.49,16.59 v13.02,15.12
RE_LFA  (via drill 0.35)
  Top 0.305: U$1.PC1 34.57,21.75 34.34,21.97 34.34,21.98 34.03,22.29 33.05,22.29 32.13,23.21 26.19,23.21 v25.49,23.91 | IRRLF.2 16,29.9 RRE1.2
  Bottom 0.305: IRRLF.2 17.49,26.51 22.89,26.51 v25.49,23.91
RE_LFB  (via drill 0.35)
  Top 0.305: U$1.PC2 34.27,21.25 33.82,21.7 32.77,21.7 31.87,22.6 25.3,22.6 v23.95,23.95 | IRRLF.1 13.1,28.9 RRE2.2
  Bottom 0.305: v23.95,23.95 22.09,25.81 16.19,25.81 IRRLF.1
RE_R  (via drill 0.35)
  Top 0.305: v74.99,8.22 76,7.21 RRE6.2 | v57.47,15.01 66.99,15.01 IRRR.1 | U$1.PB0 41.75,17.36 42.51,18.12 44.07,18.12 44.07,18.11 v44.58,17.6
  Bottom 0.305: IRRR.1 73.21,10 v74.99,8.22 | v57.47,15.01 55.68,13.22 52.38,13.22 51.74,13.86 47.72,13.86 46.11,15.47 46.11,16.08 v44.59,17.6 v44.58,17.6
RE_RFA  (via drill 0.35)
  Top 0.305: RRE3.2 66,29.9 IRRRF.1 | v61.55,23.23 62.83,24.51 v62.83,24.58 | v44.16,21.39 43.62,21.39 40.75,18.52 U$1.PC4
  Bottom 0.305: v61.55,23.23 61.12,22.8 48.79,22.8 47.38,21.39 v44.16,21.39 | v62.83,24.58 66,27.75 IRRRF.1
RE_RFB  (via drill 0.35)
  Top 0.305: v62.33,22.7 63.57,23.94 v63.57,24.04 | RRE4.2 68.9,28.9 IRRRF.2 | U$1.PC5 41.25,18.14 v43.66,20.55
  Bottom 0.305: 55.56,22.17 55.57,22.18 | v62.33,22.7 61.8,22.17 55.56,22.17 | v63.57,24.04 64.95,25.42 66.38,25.42 68,27.04 IRRRF.2 | v43.66,20.55 43.89,20.78 47.65,20.78 49.04,22.17 55.56,22.17
RENCA
  Bottom 0.305: RIGHTMOTOR.6 56.14,5.27 57.42,6.55 61.6,6.55 62.02,6.97 62.02,11.98 RM.3
RENCB
  Bottom 0.305: RIGHTMOTOR.5 55.36,4.55 56.43,4.55 57.72,5.84 61.88,5.84 62.75,6.71 62.75,10.75 RM.4
RESET  (via drill 0.35)
  Top 0.254: U$1.NRST 36.08,22.75 36.4,23.07 v36.41,27.65
  Bottom 0.254: SWD.1 36.4,29.9 v36.41,27.65 36.41,27.85
RPWMA
  Top 0.305: R_RMC_1.2 52.43,7.93 53.31,8.81 53.31,9.72 54.56,10.98 U$17.IN_B 56.97,10.98 RM.1
RPWMB
  Top 0.305: R_RMC_2.2 54.92,8.57 54.92,9.38 55.22,9.68 U$17.IN_A 56.97,9.68 58.01,10.72 58.72,10.72 RM.2
SPI2_MISO
  Top 0.254: U$1.PB14 53.75,19.25 SPI2.3
SPI2_MOSI
  Top 0.254: U$1.PB15 52.75,19.75 SPI2.4
SPI2_NSS
  Top 0.254: U$1.PB12 50.75,18.25 SPI2.1
SPI2_SCK
  Top 0.254: U$1.PB13 51.07,18.75 52.83,16.99 SPI2.2
SWCLK
  Top 0.254: U$1.PA14 44.75,28.75 SWD.4
SWDIO  (via drill 0.35)
  Top 0.254: U$1.PA13 v45.33,24.75
  Bottom 0.254: v45.33,24.75 44.75,24.75 SWD.2
VBAT  (via drill 0.35)
  Top 0.305: 26.61,11.89 26.69,11.89 28.5,10.08 28.74,10.08 29.15,9.68 U$15.VDD | U$17.VDD 52.61,10.32 53.28,10.99 | CPWR_5.1 69.59,8.96 69.31,8.68 REG3.1 | CRMC_2.A 58.73,8.65 v57.84,9.54 | CLMC_2.A 23.4,8.66 v24.08,9.34
  Top 0.61: 37.57,10.66 37.6,10.63 U$16.P1S/P2S 39.88,10.63 39.92,10.67 | U$18.P1S/P2S 42.1,9.35 42.07,9.38 | REG1.1 17.31,10.46 17.33,10.48 | 18.09,9.65 17.45,9.65 CPWR_1.1 17.4,9.95 16.72,10.63
  Bottom 0.305: v24.08,9.34 24.08,10.07 25.62,11.61 v25.62,12.82 v25.63,12.83 | v53.98,11.92 55.46,11.92 v57.84,9.54
  pour Top (isolate 0.61): 15.55,13.7 15.49,-0.75 74.88,-0.86 68.8,13.67
VCAP_1
  Top 0.254: U$1.VCAP_1 44.25,15.4 44.65,15 C_VCAP1.2
VCAP_2
  Top 0.254: U$1.VCAP_2 47.68,25.25 47.92,25.01 C_VCAP2.1
VMTR
  Top 0.305: R_VMTR_1.2 14,13.55 R_VMTR_2.1 16.02,15.53 31.38,15.53 32.44,14.47 41.72,14.47 42.25,15 U$1.PB1